# EAGLE design MBusAdapter (EAGLE 9.5.2)
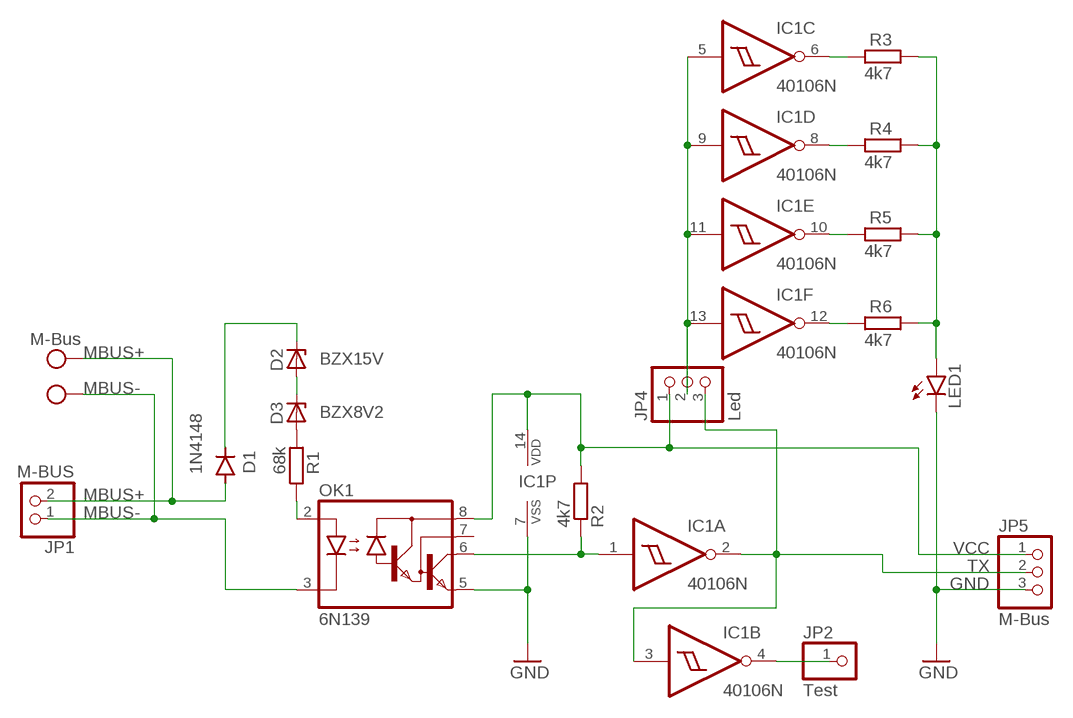
[diagram p0: schematic, sheet 1]

## Parts
D1  1N4148  1N4148DO35-10  [DO35-10]
D2  BZX15V  ZENER-DIODEDO34-7  [DO34Z7]
D3  BZX8V2  ZENER-DIODEDO34-7  [DO34Z7]
IC1  40106N  [DIL14]
JP1  M-BUS  PINHD-1X2  [1X02]
JP2  Test  PINHD-1X1  [1X01]
JP4  Led  PINHD-1X3  [1X03]
JP5  M-Bus  PINHD-1X3  [1X03]
LED1  TLLG4400  [LED3MM]
M-BUS  M-Bus  W237-102  [W237-102]
OK1  6N139  6N138  [DIL08]
R1  68k  R-EU_0207/10  [0207/10]
R2  4k7  R-EU_0207/10  [0207/10]
R3  4k7  R-EU_0207/10  [0207/10]
R4  4k7  R-EU_0207/10  [0207/10]
R5  4k7  R-EU_0207/10  [0207/10]
R6  4k7  R-EU_0207/10  [0207/10]

## Nets
GND: IC1.7(P:VSS) JP5.3 LED1.K(C) OK1.5(GND)
MBUS+: D1.A JP1.2 M-BUS.2
MBUS-: JP1.1 M-BUS.1 OK1.3(C)
N$1: D1.C D2.C
N$2: D2.A D3.C
N$3: D3.A R1.2
N$4: OK1.2(A) R1.1
N$5: IC1.6(C:O) R3.2
N$6: IC1.1(A:I) OK1.6(VO) R2.1
N$7: IC1.8(D:O) R4.2
N$8: IC1.10(E:O) R5.2
N$9: IC1.12(F:O) R6.2
N$10: LED1.A R3.1 R4.1 R5.1 R6.1
N$11: IC1.5(C:I) IC1.9(D:I) IC1.11(E:I) IC1.13(F:I) JP4.2
N$12: IC1.4(B:O) JP2.1
TX: IC1.2(A:O) IC1.3(B:I) JP4.3 JP5.2
VCC: IC1.14(P:VDD) JP4.1 JP5.1 OK1.8(VCC) R2.2
Unconnected: OK1.7(VB)

## Library data of the parts
D1 = diode:1N4148: DIODE high speed (Philips)
D2 D3 = diode:ZENER-DIODE: Z-Diode
IC1 = 40xx:40106: Hex SCHMITT TRIGGER
JP1 = pinhead:PINHD-1X2: PIN HEADER
JP2 = pinhead:PINHD-1X1: PIN HEADER
JP4 JP5 = pinhead:PINHD-1X3: PIN HEADER
LED1 = led:TLLG4400: Low Current (2mA) LED 3 mm Tinted Diffused Package color GREEN Source: Data sheet <http://www.farnell.com/datasheets/391098.pdf>; MF: VISHAY SEMICONDUCTOR; OC_FARNELL: 1612435
M-BUS = con-wago-500:W237-102: WAGO SCREW CLAMP; MPN: 237-102; OC_FARNELL: unknown; OC_NEWARK: 70K9898
OK1 = optocoupler:6N138: MOTOROLA OPTO COUPLER; MF: VISHAY/TELEFUNKEN; MPN: 6N138; OC_FARNELL: 9860150; OC_NEWARK: 35K5294
R1-R6 = resistor:R-EU_: RESISTOR, European symbol

## Board
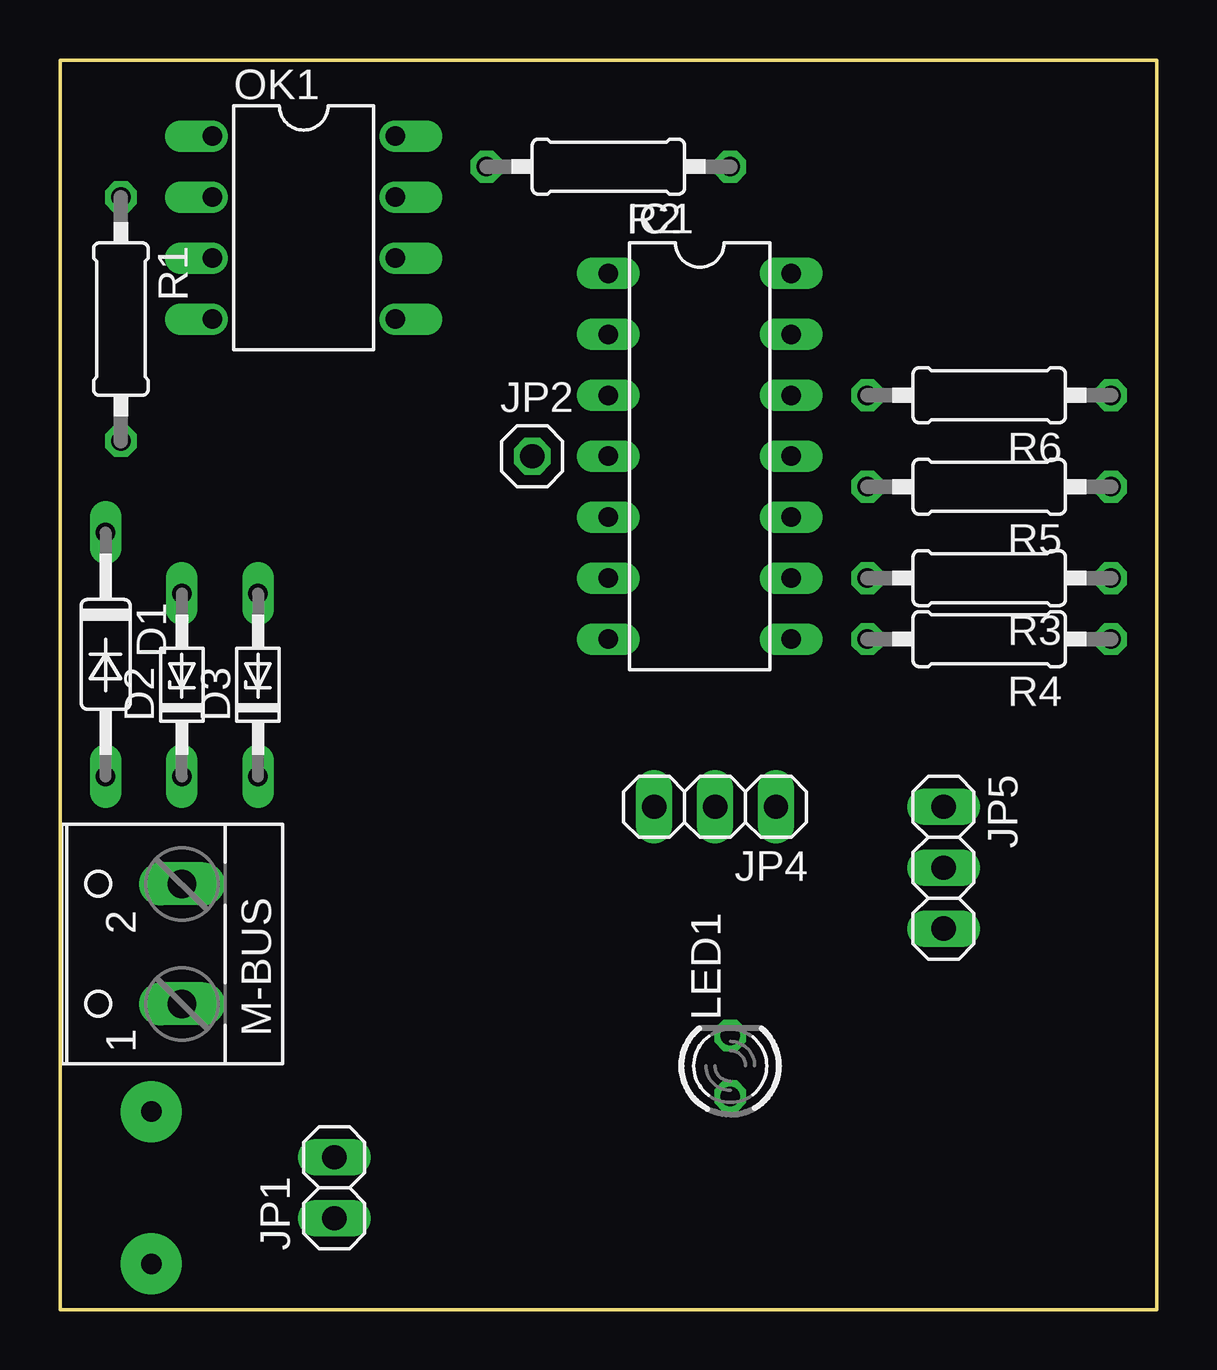
[diagram p1: board, top side]
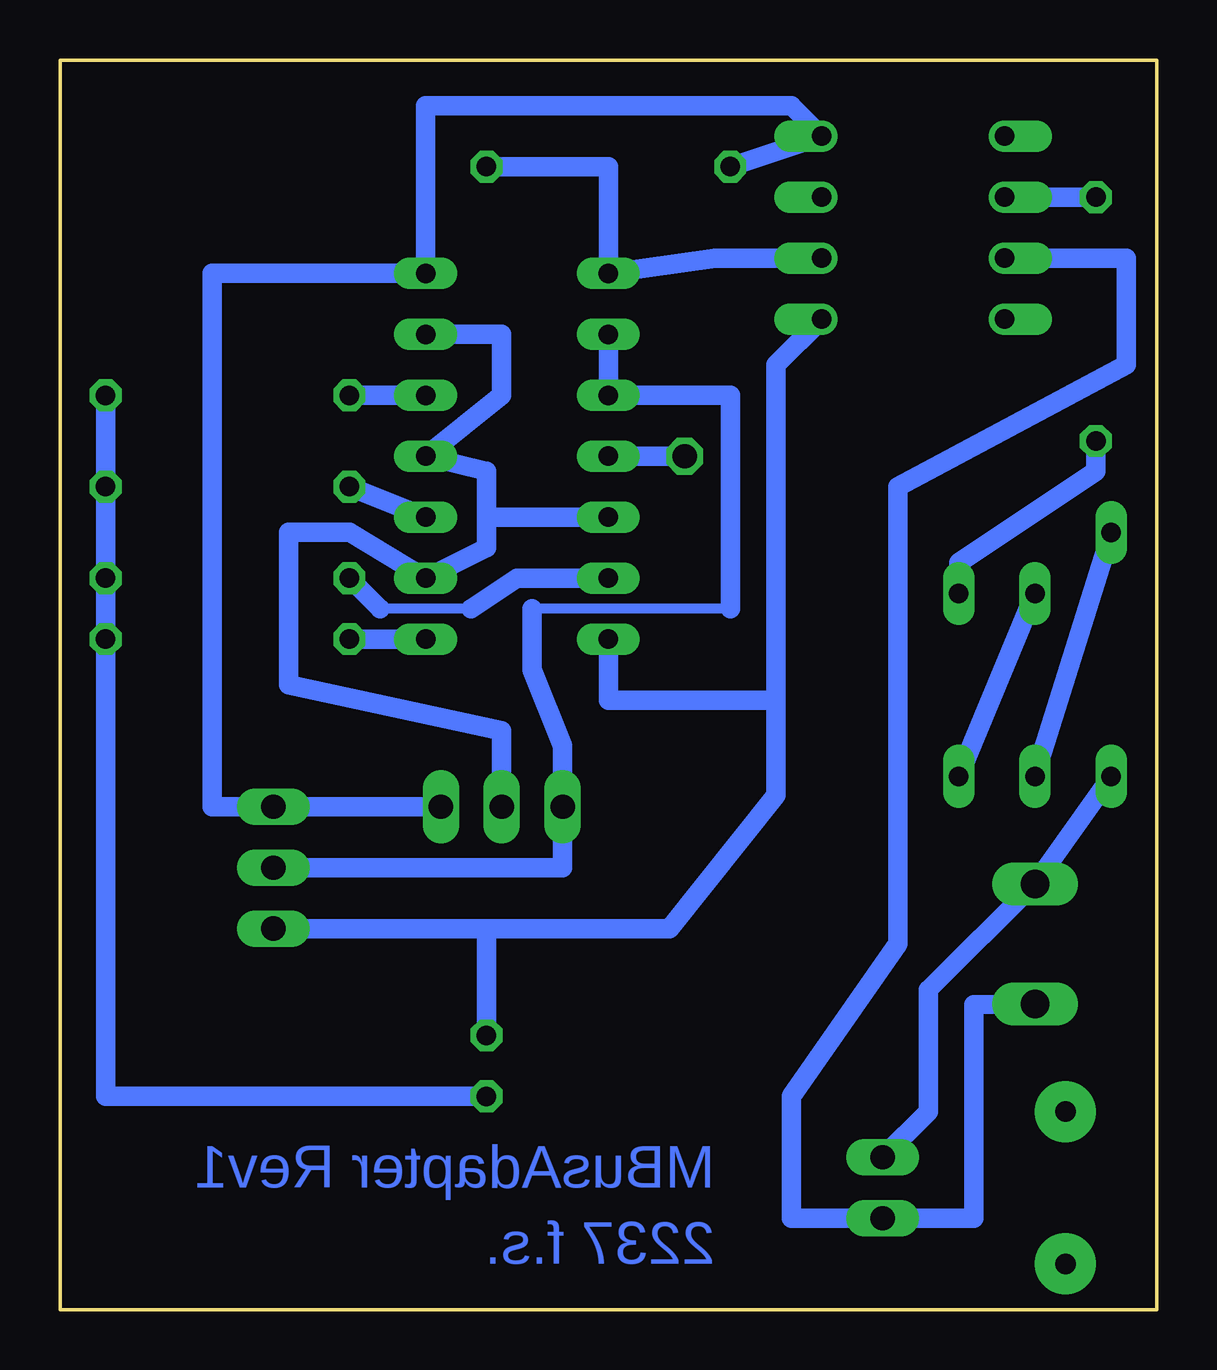
[diagram p2: board, bottom side, seen from below]

Size 45.72 x 52.07 mm. Coordinates in mm from the lower left corner, seen from the top.
Outline: 0,0 0,52.07 45.72,52.07 45.72,0 0,0
Copper layers (1*16): Top 0.035mm / dielectric 1.5mm / Bottom 0.035mm
Design rules "MyLayout": minimum track width 24mil, minimum drill 24mil, track to track 8mil, track to pad 8mil, pad to pad 8mil, via to via 8mil, smd to smd 8mil, copper to edge 20mil, drill to drill 8mil, minimum pad ring 10mil, minimum via ring 8mil, stop-mask expansion 4mil, vias tented up to drill 0mil, thermal gap 10mil

### Footprints (pad centres in the part's own frame; a part is rotated, then mirrored left to right if it is on the bottom)
DO35-10 = drill 0.813 long: A 5.08,0; C -5.08,0
DO34Z7 = drill 0.813 long: A 3.81,0; C -3.81,0
DIL14 = drill 0.813 long: 1 -7.62,-3.81; 2 -5.08,-3.81; 3 -2.54,-3.81; 4 0,-3.81; 5 2.54,-3.81; 6 5.08,-3.81; 7 7.62,-3.81; 8 7.62,3.81; 9 5.08,3.81; 10 2.54,3.81; 11 0,3.81; 12 -2.54,3.81; 13 -5.08,3.81; 14 -7.62,3.81
1X02 = drill 1.016 long: 1 -1.27,0; 2 1.27,0
1X01 = drill 1.016 octagon: 1 0,0
1X03 = drill 1.016 long: 1 -2.54,0; 2 0,0; 3 2.54,0
LED3MM = drill 0.813 octagon: A -1.27,0; K 1.27,0
W237-102 = drill 1.194 long: 1 -2.5,-1.27; 2 2.5,-1.27
DIL08 = drill 0.813 offset: 1 -3.81,-3.81; 2 -1.27,-3.81; 3 1.27,-3.81; 4 3.81,-3.81; 5 3.81,3.81; 6 1.27,3.81; 7 -1.27,3.81; 8 -3.81,3.81
0207/10 = drill 0.813 octagon: 1 -5.08,0; 2 5.08,0

### Placement (x,y rotation side)
D1  1.91,27.3 270 top
D2  5.08,26.04 90 top
D3  8.26,26.04 90 top
IC1  26.67,35.56 270 top
JP1  11.43,5.08 90 top
JP2  19.68,35.56 0 top
JP4  27.3,20.95 180 top
JP5  36.83,18.41 270 top
LED1  27.94,10.16 90 top
M-BUS  3.81,15.24 90 top
OK1  10.16,45.09 270 top
R1  2.54,41.27 270 top
R2  22.86,47.62 180 top
R3  38.73,30.48 180 top
R4  38.73,27.94 180 top
R5  38.73,34.29 180 top
R6  38.73,38.1 180 top

### Tracks (layer width: path | path; a pad name or v marks a point on that pad's centre or on a via)
GND
  Bottom 0.813: JP5.3 27.94,15.88 | 27.94,15.88 20.32,15.88 15.88,21.43 15.88,25.4 | OK1.5 15.88,39.37 15.88,25.4 | IC1.7 22.86,25.4 15.88,25.4 | LED1.K 27.94,15.88
MBUS+
  Bottom 0.813: JP1.2 9.53,8.26 9.53,13.33 M-BUS.2 D1.A
MBUS-
  Bottom 0.813: M-BUS.1 7.62,12.7 7.62,3.81 JP1.1 15.24,3.81 15.24,8.89 10.79,15.24 10.79,34.29 1.27,39.37 1.27,43.81 OK1.3
N$1
  Bottom 0.813: D2.C D1.C
N$2
  Bottom 0.813: D3.C D2.A
N$3
  Bottom 0.813: R1.2 2.54,34.92 8.26,31.11 D3.A
N$4
  Bottom 0.813: R1.1 OK1.2
N$5
  Bottom 0.406: 28.57,29.21 32.38,29.21
  Bottom 0.813: IC1.6 26.67,30.48 28.57,29.21 | 32.38,29.21 R3.2
N$6
  Bottom 0.813: OK1.6 18.41,43.81 IC1.1 22.86,47.62 R2.1
N$7
  Bottom 0.813: IC1.8 R4.2
N$8
  Bottom 0.813: IC1.10 R5.2
N$9
  Bottom 0.813: IC1.12 R6.2
N$10
  Bottom 0.813: R6.1 R5.1 R3.1 R4.1 43.81,8.89 LED1.A
N$11
  Bottom 0.813: IC1.13 27.3,40.64 27.3,38.1 IC1.11 27.94,34.92 27.94,33.02 | JP4.2 27.3,24.13 36.2,26.04 36.2,32.38 33.66,32.38 IC1.9 27.94,31.75 27.94,33.02 | IC1.5 27.94,33.02
N$12
  Bottom 0.813: JP2.1 IC1.4
N$13  (via drill 0.85 pad 2.54)
  other vias: 3.81,1.91
N$14  (via drill 0.85 pad 2.54)
  other vias: 3.81,8.26
TX
  Bottom 0.406: 17.78,29.21 26.04,29.21
  Bottom 0.813: JP5.2 24.77,18.41 JP4.3 24.77,23.5 26.04,26.67 26.04,29.21 | IC1.2 IC1.3 17.78,38.1 17.78,29.21
VCC
  Bottom 0.813: JP4.1 JP5.1 39.37,20.95 39.37,43.18 IC1.14 30.48,50.16 15.24,50.16 OK1.8 R2.2

### Text on the board
Bottom: MBusAdapter Rev1 | 2237 f.s.
Document: Test | Led | VCC | on | off | mbus+ | TX | MBus | mbus- | GND | UART | mbus+ | mbus- | MBusAdapter Rev1 | MBus | 2237 f.s.